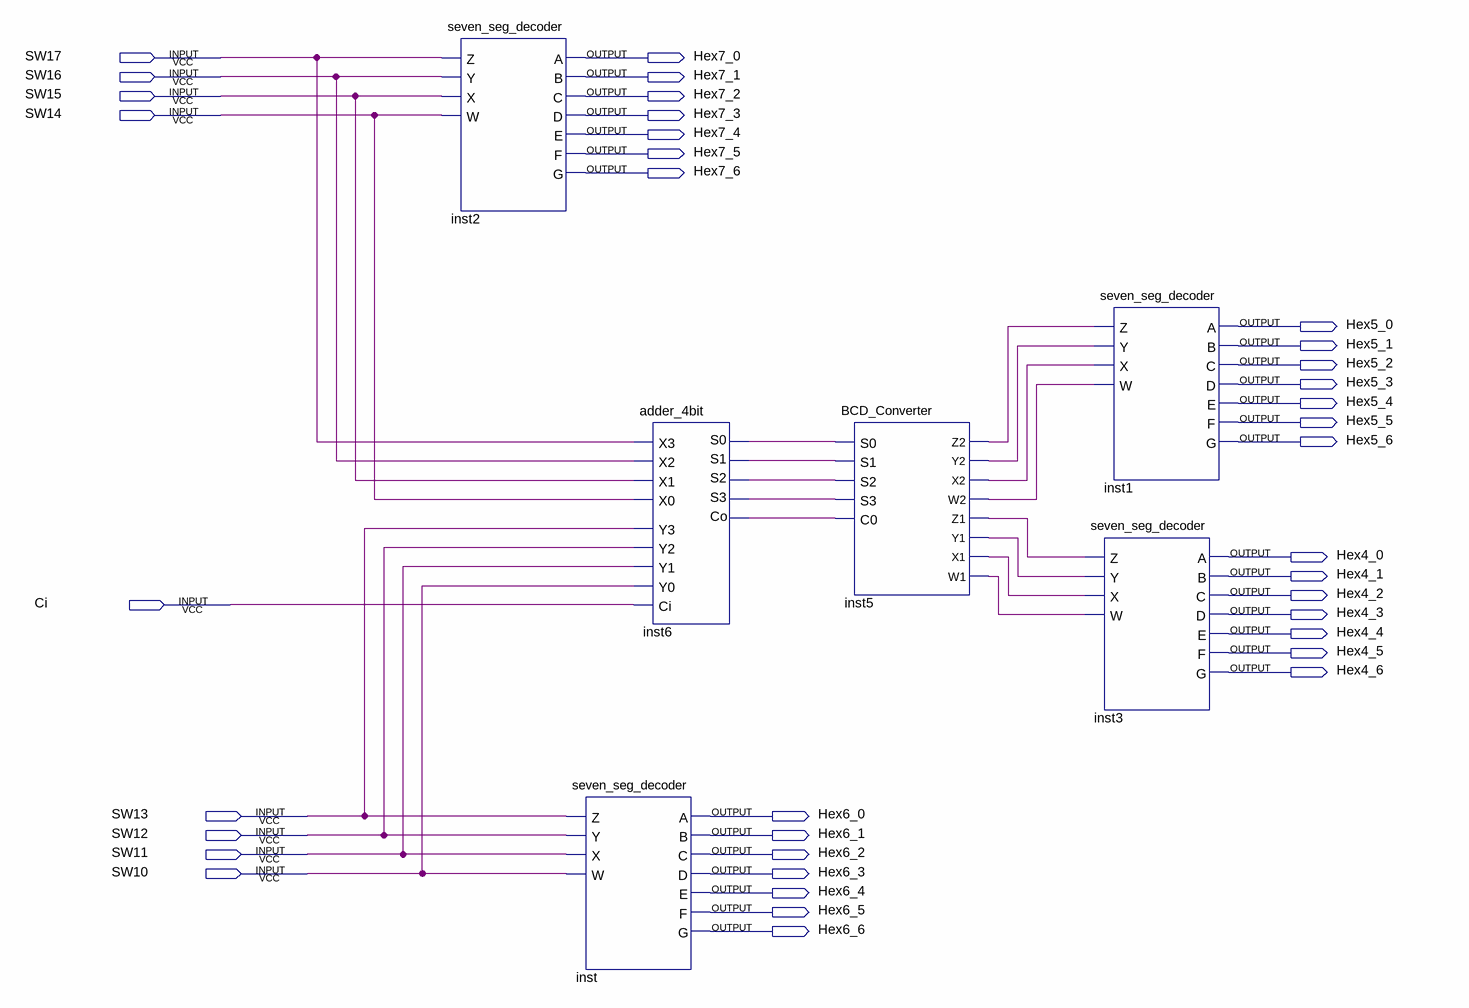
[diagram p0: schematic sheet]
// Quartus schematic lab05step1.bdf as structural Verilog: 6 symbols, 37 pins
module lab05step1 (
  input  SW17,
  input  SW16,
  input  SW15,
  input  SW14,
  input  Ci,
  input  SW13,
  input  SW12,
  input  SW11,
  input  SW10,
  output Hex7_0,
  output Hex7_1,
  output Hex7_2,
  output Hex7_3,
  output Hex7_4,
  output Hex7_5,
  output Hex7_6,
  output Hex5_0,
  output Hex5_1,
  output Hex5_2,
  output Hex5_3,
  output Hex5_4,
  output Hex5_5,
  output Hex5_6,
  output Hex4_0,
  output Hex4_1,
  output Hex4_2,
  output Hex4_3,
  output Hex4_4,
  output Hex4_5,
  output Hex4_6,
  output Hex6_0,
  output Hex6_1,
  output Hex6_2,
  output Hex6_3,
  output Hex6_4,
  output Hex6_5,
  output Hex6_6
);

  wire inst5_w1, inst5_w2, inst5_x1, inst5_x2, inst5_y1, inst5_y2, inst5_z1, inst5_z2, inst6_co, inst6_s0,
       inst6_s1, inst6_s2, inst6_s3;

  seven_seg_decoder inst2 (
    .Z(SW17), .Y(SW16), .X(SW15), .W(SW14), .A(Hex7_0), .B(Hex7_1), .C(Hex7_2), .D(Hex7_3), .E(Hex7_4),
    .F(Hex7_5), .G(Hex7_6));
  seven_seg_decoder inst (
    .Z(SW13), .Y(SW12), .X(SW11), .W(SW10), .A(Hex6_0), .B(Hex6_1), .C(Hex6_2), .D(Hex6_3), .E(Hex6_4),
    .F(Hex6_5), .G(Hex6_6));
  adder_4bit inst6 (
    .X3(SW17), .Y3(SW13), .X2(SW16), .Y2(SW12), .X1(SW15), .Y1(SW11), .X0(SW14), .Y0(SW10), .Ci(Ci),
    .S0(inst6_s0), .S1(inst6_s1), .S2(inst6_s2), .S3(inst6_s3), .Co(inst6_co));
  BCD_Converter inst5 (
    .S0(inst6_s0), .S1(inst6_s1), .S2(inst6_s2), .S3(inst6_s3), .C0(inst6_co), .Z2(inst5_z2), .Y2(inst5_y2),
    .X2(inst5_x2), .W2(inst5_w2), .Z1(inst5_z1), .Y1(inst5_y1), .X1(inst5_x1), .W1(inst5_w1));
  seven_seg_decoder inst1 (
    .Z(inst5_z2), .Y(inst5_y2), .X(inst5_x2), .W(inst5_w2), .A(Hex5_0), .B(Hex5_1), .C(Hex5_2), .D(Hex5_3),
    .E(Hex5_4), .F(Hex5_5), .G(Hex5_6));
  seven_seg_decoder inst3 (
    .Z(inst5_z1), .Y(inst5_y1), .X(inst5_x1), .W(inst5_w1), .A(Hex4_0), .B(Hex4_1), .C(Hex4_2), .D(Hex4_3),
    .E(Hex4_4), .F(Hex4_5), .G(Hex4_6));
endmodule
